# EAGLE schematic shield_sporecollector v4 (EAGLE 9.1.0)
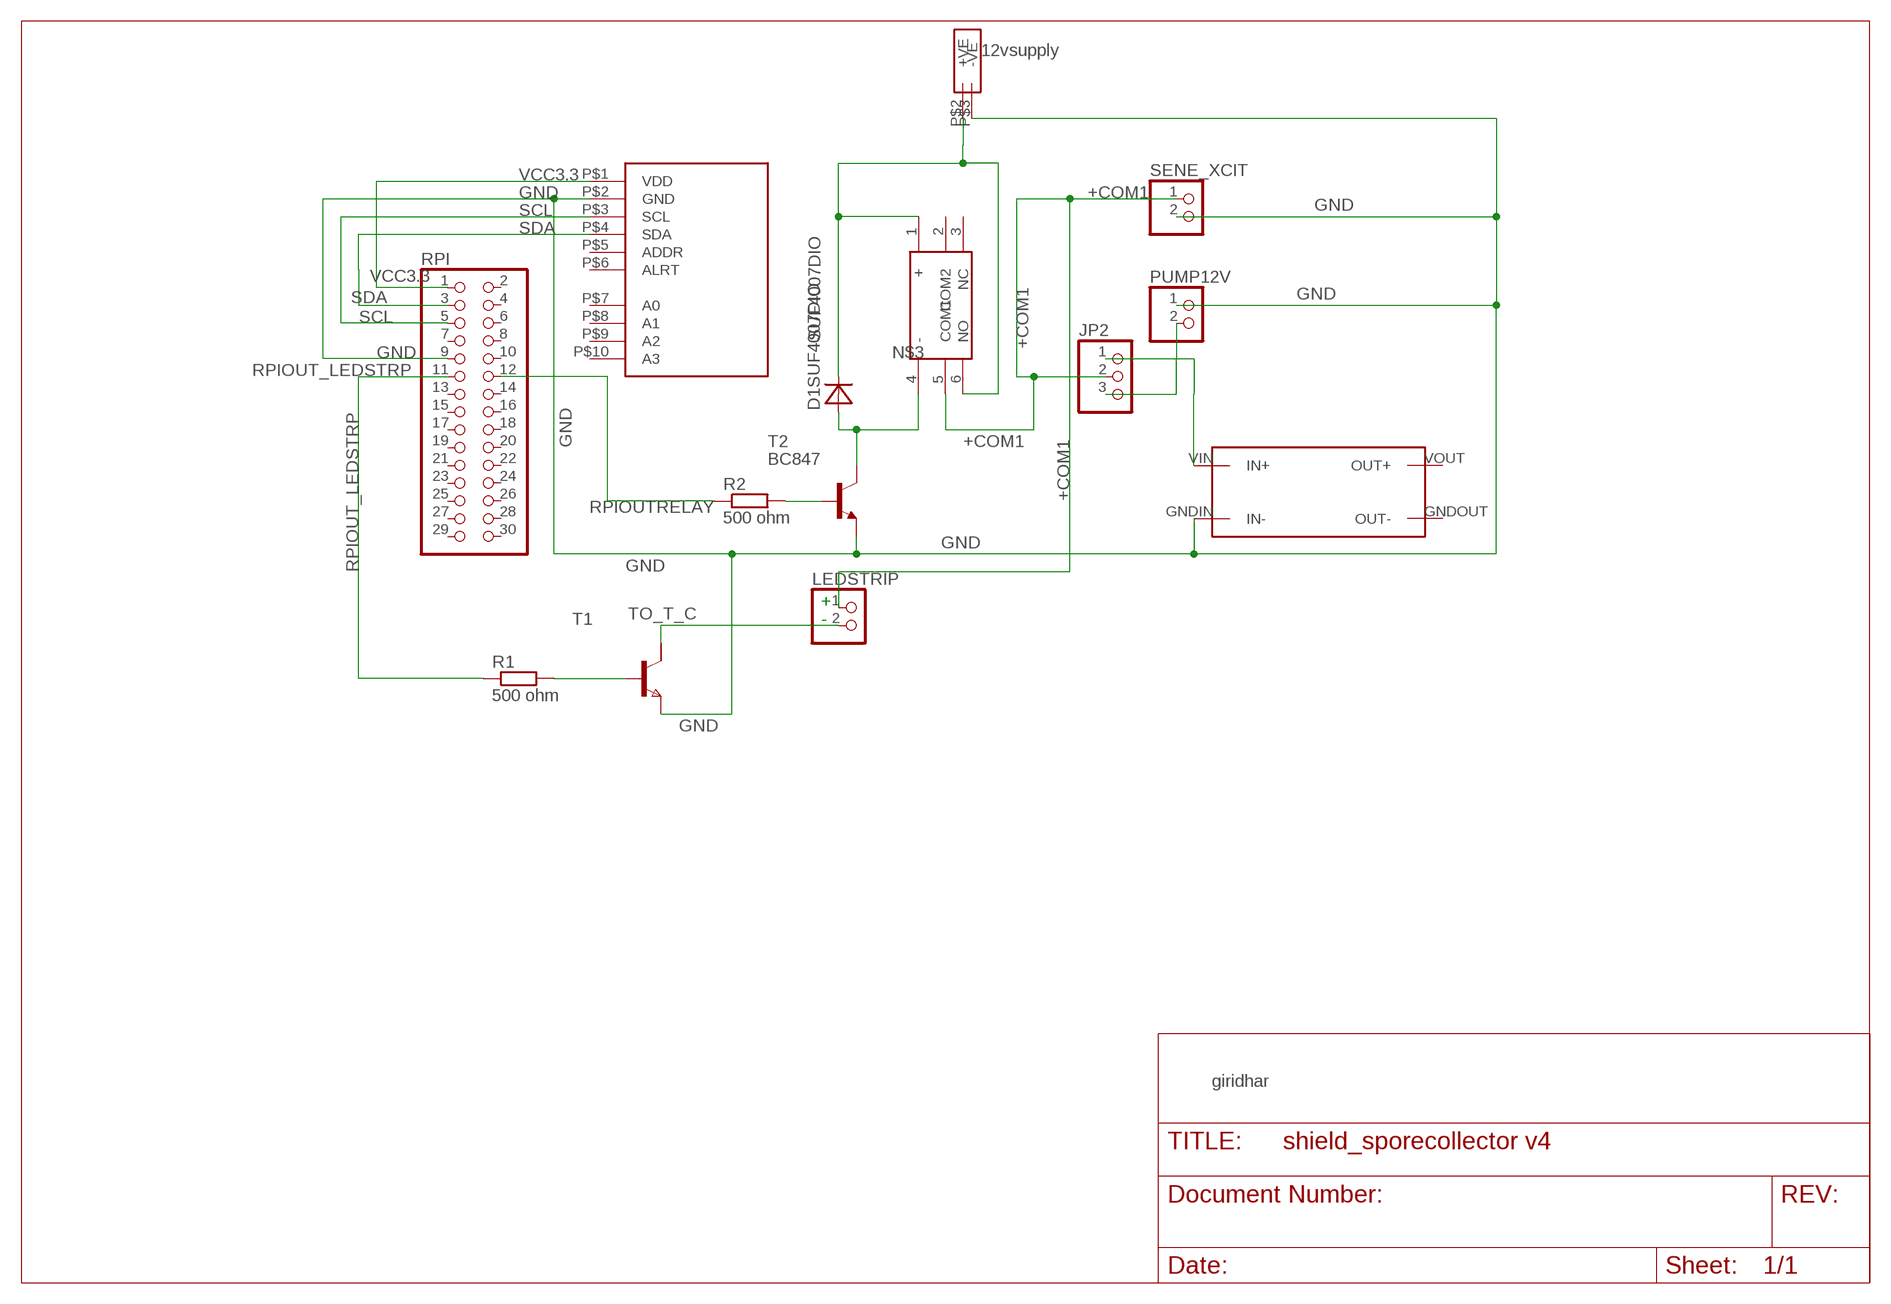
[diagram p0: schematic, sheet 1]

## Parts
BUCHSE12VINPUT  BUCHSE9.8X14.6  [BUCHSE9.8X14.6]
D1SUF4007DIO  SUF4007DIO  [SUF4007]
JP2  PINHD-1X3  [1X03]
LEDSTRIP  PINHD-1X2  [1X02]
PUMP12V  PINHD-1X2  [1X02]
R1  500 ohm  R-EU_R0603  [R0603]
R2  500 ohm  R-EU_R0603  [R0603]
RPI  PINHD-2X15  [2X15]
SENE_XCIT  PINHD-1X2  [1X02]
STEPUP12TO24V  24VSTEPUPPOLOLUSMDSMD  [STEP-UP24VSMD]
T1  NPNSOT223  [SOT223]
T2  BC847  [SOT23]
U$3  ADC-4CH-ADS1115/WITHOUTHOLESADC-ADS1115WITHOUTHOLES  [ADC-4CH-ADS1115/WITHOUTHOLES]
U$4  G6B-2114POMRON  [G6B-2114P]

## Nets
+COM1: JP2.2 LEDSTRIP.1 SENE_XCIT.1 U$4.5(COM1)
GND: BUCHSE12VINPUT.P$3(-VE) PUMP12V.1 RPI.9 SENE_XCIT.2 STEPUP12TO24V.GNDIN(IN-) T1.3(E) T2.2(E) U$3.P$2(GND)
N$1: R2.2 T2.1(B)
N$2: R1.2 T1.1(B)
N$3: BUCHSE12VINPUT.P$2(+VE) D1SUF4007DIO.C U$4.1(+) U$4.6(NO)
N$4: JP2.3 PUMP12V.2
N$5: JP2.1 STEPUP12TO24V.VIN(IN+)
RELAY_T3_-_COIL: D1SUF4007DIO.A T2.3(C) U$4.4(-)
RPIOUT_LEDSTRP: R1.1 RPI.11
RPIOUTRELAY: R2.1 RPI.12
SCL: RPI.5 U$3.P$3(SCL)
SDA: RPI.3 U$3.P$4(SDA)
TO_T_C: LEDSTRIP.2 T1.2(C1)
VCC3.3: RPI.1 U$3.P$1(VDD)
Unconnected: RPI.2 RPI.4 RPI.6 RPI.7 RPI.8 RPI.10 RPI.13 RPI.14 RPI.15 RPI.16 RPI.17 RPI.18 RPI.19 RPI.20 RPI.21 RPI.22 RPI.23 RPI.24 RPI.25 RPI.26 RPI.27 RPI.28 RPI.29 RPI.30 STEPUP12TO24V.GNDOUT(OUT-) STEPUP12TO24V.VOUT(OUT+) T1.4(C2) U$3.P$5(ADDR) U$3.P$6(ALRT) U$3.P$7(A0) U$3.P$8(A1) U$3.P$9(A2) U$3.P$10(A3) U$4.2(COM2) U$4.3(NC)

## Notes on the sheet
- 12vsupply
- +
- -
- giridhar

## Library data of the parts
BUCHSE12VINPUT = Buchse:BUCHSE9.8X14.6
D1SUF4007DIO = diode:SUF4007DIO
JP2 = pinhead:PINHD-1X3: PIN HEADER
LEDSTRIP PUMP12V SENE_XCIT = pinhead:PINHD-1X2: PIN HEADER
R1 R2 = resistor:R-EU_: RESISTOR, European symbol
RPI = pinhead:PINHD-2X15: PIN HEADER
STEPUP12TO24V = pololu24stepup:24VSTEPUPPOLOLUSMD
T1 = zetex_:NPNSOT223: NPN TRANSISTOR
T2 = transistor:BC847: NPN TRANSISTOR
U$3 = diy-modules:ADC-4CH-ADS1115/WITHOUTHOLES: 4 Channel 16-Bit Analog-to-Digital Converter based on ADS1115 chip Arduino ADS1115 Getting Started Tutorial is available here: http://henrysbench.capnfatz.com/henrys-bench/arduino-voltage-measurements/arduino-ads1115-module-getting-started-tutorial/ ADS1115 datasheet is available here: http://www.ti.com/lit/ds/symlink/ads1115.pdf Click here to find device on ebay.com <http://www.ebay.com/sch/ads1115+module>
U$4 = G6B2114PUSDC12:G6B-2114POMRON